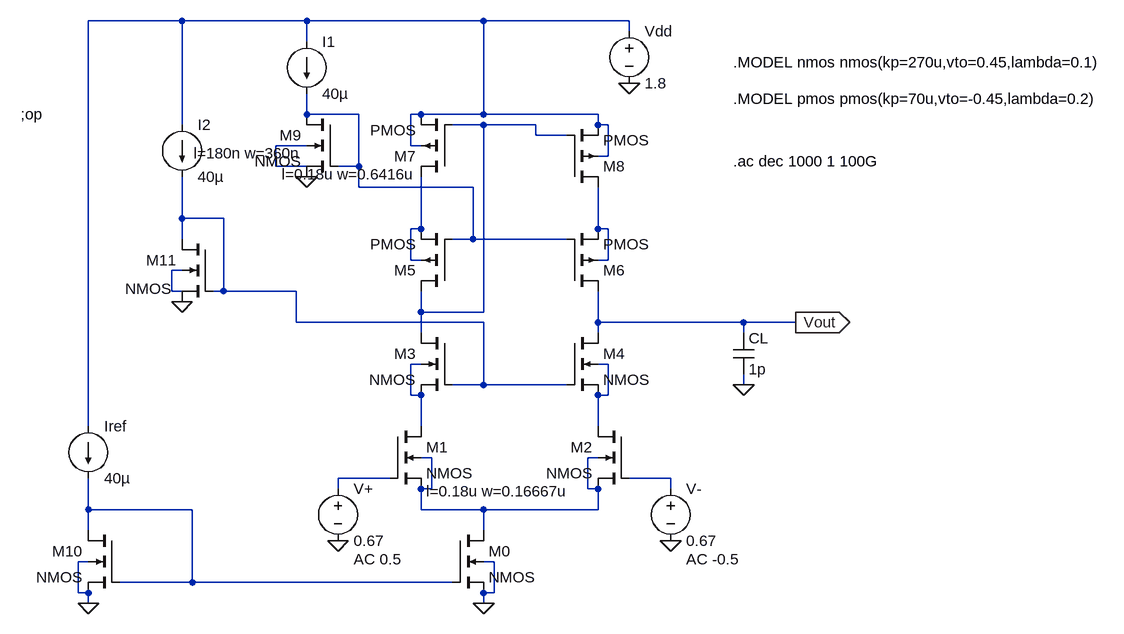
[diagram p0: schematic telescopic.asc]
telescopic.asc, the LTspice schematic file:
Version 4
SHEET 1 1260 680
WIRE -256 -448 -400 -448
WIRE -64 -448 -256 -448
WIRE 208 -448 -64 -448
WIRE 432 -448 208 -448
WIRE 432 -432 432 -448
WIRE -64 -416 -64 -448
WIRE -64 -304 -64 -336
WIRE 16 -304 -64 -304
WIRE 112 -304 96 -304
WIRE 208 -304 208 -448
WIRE 208 -304 112 -304
WIRE 384 -304 208 -304
WIRE -256 -288 -256 -448
WIRE 208 -288 160 -288
WIRE 288 -288 208 -288
WIRE 384 -288 384 -304
WIRE 400 -288 384 -288
WIRE 288 -272 288 -288
WIRE 336 -272 288 -272
WIRE -64 -256 -112 -256
WIRE 96 -256 96 -304
WIRE 112 -256 96 -256
WIRE 400 -240 400 -288
WIRE 400 -240 384 -240
WIRE -112 -224 -112 -256
WIRE -64 -224 -112 -224
WIRE 16 -224 16 -304
WIRE 16 -224 -16 -224
WIRE 16 -192 16 -224
WIRE 192 -192 16 -192
WIRE -256 -144 -256 -208
WIRE -192 -144 -256 -144
WIRE 112 -128 112 -208
WIRE 112 -128 96 -128
WIRE 384 -128 384 -192
WIRE 400 -128 384 -128
WIRE -256 -112 -256 -144
WIRE 192 -112 192 -192
WIRE 192 -112 160 -112
WIRE 336 -112 192 -112
WIRE 96 -80 96 -128
WIRE 112 -80 96 -80
WIRE 400 -80 400 -128
WIRE 400 -80 384 -80
WIRE -256 -64 -272 -64
WIRE -272 -32 -272 -64
WIRE -256 -32 -272 -32
WIRE -192 -32 -192 -144
WIRE -192 -32 -208 -32
WIRE -80 -32 -192 -32
WIRE 112 0 112 -32
WIRE 208 0 208 -288
WIRE 208 0 112 0
WIRE -80 16 -80 -32
WIRE 208 16 -80 16
WIRE 384 16 384 -32
WIRE 608 16 384 16
WIRE 688 16 608 16
WIRE 112 32 112 0
WIRE 384 32 384 16
WIRE 608 32 608 16
WIRE 112 80 96 80
WIRE 400 80 384 80
WIRE 208 112 208 16
WIRE 208 112 160 112
WIRE 336 112 208 112
WIRE 608 112 608 96
WIRE 96 128 96 80
WIRE 112 128 96 128
WIRE 400 128 400 80
WIRE 400 128 384 128
WIRE -400 176 -400 -448
WIRE 112 176 112 128
WIRE 384 176 384 128
WIRE 128 224 112 224
WIRE 384 224 368 224
WIRE 64 256 -16 256
WIRE 496 256 432 256
WIRE -16 272 -16 256
WIRE 128 272 128 224
WIRE 128 272 112 272
WIRE 368 272 368 224
WIRE 384 272 368 272
WIRE 496 272 496 256
WIRE -400 304 -400 256
WIRE -240 304 -400 304
WIRE 112 304 112 272
WIRE 208 304 112 304
WIRE 384 304 384 272
WIRE 384 304 208 304
WIRE -400 336 -400 304
WIRE 208 336 208 304
WIRE -400 384 -416 384
WIRE 224 384 208 384
WIRE -240 416 -240 304
WIRE -240 416 -352 416
WIRE 160 416 -240 416
WIRE -416 432 -416 384
WIRE -400 432 -416 432
WIRE 224 432 224 384
WIRE 224 432 208 432
WIRE -400 448 -400 432
WIRE -400 448 -416 448
WIRE 208 448 208 432
FLAG 208 448 0
FLAG 432 -352 0
FLAG 496 352 0
FLAG -16 352 0
FLAG 688 16 Vout
IOPIN 688 16 Out
FLAG 608 112 0
FLAG -400 448 0
FLAG -64 -208 0
FLAG -256 -16 0
SYMBOL nmos4 64 176 R0
WINDOW 123 56 100 Left 2
SYMATTR Value2 l=0.18u w=0.16667u
SYMATTR InstName M1
SYMBOL nmos4 432 176 M0
SYMATTR InstName M2
SYMATTR Value2 l=0.18u w=0.16667u
SYMBOL nmos4 160 32 M0
SYMATTR InstName M3
SYMATTR Value2 l=0.18u w=0.16667u
SYMBOL nmos4 336 32 R0
SYMATTR InstName M4
SYMATTR Value2 l=0.18u w=0.16667u
SYMBOL pmos4 160 -32 R180
SYMATTR InstName M5
SYMATTR Value2 l=0.18u w=0.6416u
SYMBOL pmos4 336 -32 M180
SYMATTR InstName M6
SYMATTR Value2 l=0.18u w=0.6416u
SYMBOL pmos4 160 -208 R180
WINDOW 123 56 4 Left 2
SYMATTR Value2 l=0.18u w=0.6416u
SYMATTR InstName M7
SYMBOL pmos4 336 -192 M180
SYMATTR InstName M8
SYMATTR Value2 l=0.18u w=0.6416u
SYMBOL nmos4 160 336 R0
SYMATTR InstName M0
SYMATTR Value2 l=0.18u w=0.22u
SYMBOL voltage 432 -448 R0
WINDOW 123 0 0 Left 2
WINDOW 39 0 0 Left 2
SYMATTR InstName Vdd
SYMATTR Value 1.8
SYMBOL voltage -16 256 R0
WINDOW 123 24 124 Left 2
WINDOW 39 0 0 Left 2
SYMATTR Value2 AC 0.5
SYMATTR InstName V+
SYMATTR Value 0.67
SYMBOL voltage 496 256 R0
WINDOW 123 24 124 Left 2
WINDOW 39 0 0 Left 2
SYMATTR Value2 AC -0.5
SYMATTR InstName V-
SYMATTR Value 0.67
SYMBOL cap 592 32 R0
SYMATTR InstName CL
SYMATTR Value 1p
SYMBOL nmos4 -352 336 M0
SYMATTR InstName M10
SYMATTR Value2 l=180n w=360n
SYMBOL current -400 176 R0
WINDOW 123 0 0 Left 2
WINDOW 39 0 0 Left 2
SYMATTR InstName Iref
SYMATTR Value 40µ
SYMBOL current -64 -416 R0
WINDOW 123 0 0 Left 2
WINDOW 39 0 0 Left 2
SYMATTR InstName I1
SYMATTR Value 40µ
SYMBOL current -256 -288 R0
SYMATTR InstName I2
SYMATTR Value 40µ
SYMBOL nmos4 -16 -304 M0
WINDOW 123 56 60 Left 2
SYMATTR Value2 l=180n w=360n
SYMATTR InstName M9
SYMBOL nmos4 -208 -112 M0
WINDOW 3 63 76 Left 2
SYMATTR InstName M11
SYMATTR Value2 l=180n w=360n
TEXT 592 -384 Left 2 !.MODEL nmos nmos(kp=270u,vto=0.45,lambda=0.1)
TEXT 592 -328 Left 2 !.MODEL pmos pmos(kp=70u,vto=-0.45,lambda=0.2)
TEXT 592 -232 Left 2 !.ac dec 1000 1 100G
TEXT -504 -304 Left 2 !;op

The netlist it stands for:
* telescopic.asc
M1 N009 N012 N011 N011 NMOS l=0.18u w=0.16667u
M2 N010 N013 N011 N011 NMOS l=0.18u w=0.16667u
M3 N003 N005 N009 N009 NMOS l=0.18u w=0.16667u
M4 Vout N005 N010 N010 NMOS l=0.18u w=0.16667u
M5 N003 N002 N006 N006 PMOS l=0.18u w=0.6416u
M6 Vout N002 N007 N007 PMOS l=0.18u w=0.6416u
M7 N006 N003 N001 N001 PMOS l=0.18u w=0.6416u
M8 N007 N003 N001 N001 PMOS l=0.18u w=0.6416u
M0 N011 N014 0 0 NMOS l=0.18u w=0.22u
Vdd N001 0 1.8
V+ N012 0 0.67 AC 0.5
V- N013 0 0.67 AC -0.5
CL Vout 0 1p
M10 N014 N014 0 0 NMOS l=180n w=360n
Iref N001 N014 40µ
I1 N001 N002 40µ
I2 N001 N005 40µ
M9 N002 N002 0 N004 NMOS l=180n w=360n
M11 N005 N005 0 N008 NMOS l=180n w=360n
.model NMOS NMOS
.model PMOS PMOS
.lib standard.mos
.MODEL nmos nmos(kp=270u,vto=0.45,lambda=0.1)
.MODEL pmos pmos(kp=70u,vto=-0.45,lambda=0.2)
.ac dec 1000 1 100G
;op
.backanno
.end